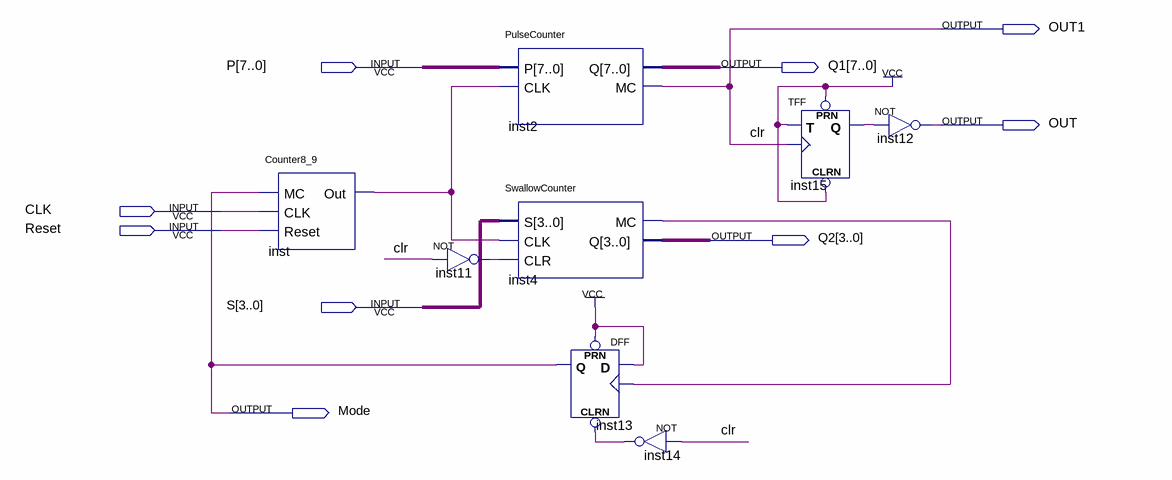
[diagram p0: schematic sheet]
// Quartus schematic PSCounter.bdf as structural Verilog: 8 symbols, 9 pins
module PSCounter (
  input  [7:0] P,
  input  CLK,
  input  Reset,
  input  [3:0] S,
  output OUT1,
  output [7:0] Q1,
  output OUT,
  output [3:0] Q2,
  output Mode
);

  wire inst4_mc, inst11_out, inst14_out, inst15_q, inst_out;

  Counter8_9 inst (.MC(Mode), .CLK(CLK), .Reset(Reset), .Out(inst_out));
  not inst11 (inst11_out, OUT1);
  PulseCounter inst2 (.P(P), .CLK(inst_out), .Q(Q1), .MC(OUT1));
  SwallowCounter inst4 (.S(S), .CLK(inst_out), .CLR(inst11_out), .MC(inst4_mc), .Q(Q2));
  DFF inst13 (.CLRN(inst14_out), .CLK(inst4_mc), .D(1'b1), .PRN(1'b1), .Q(Mode));
  not inst14 (inst14_out, OUT1);
  TFF inst15 (.PRN(1'b1), .CLRN(1'b1), .T(1'b1), .CLK(OUT1), .Q(inst15_q));
  not inst12 (OUT, inst15_q);

  // Other names for the same wires on the sheet: clr = OUT1
endmodule
